# EAGLE design 140810_AriloTX_REV3_0_0_868MHZ_td (EAGLE 6.5.0)
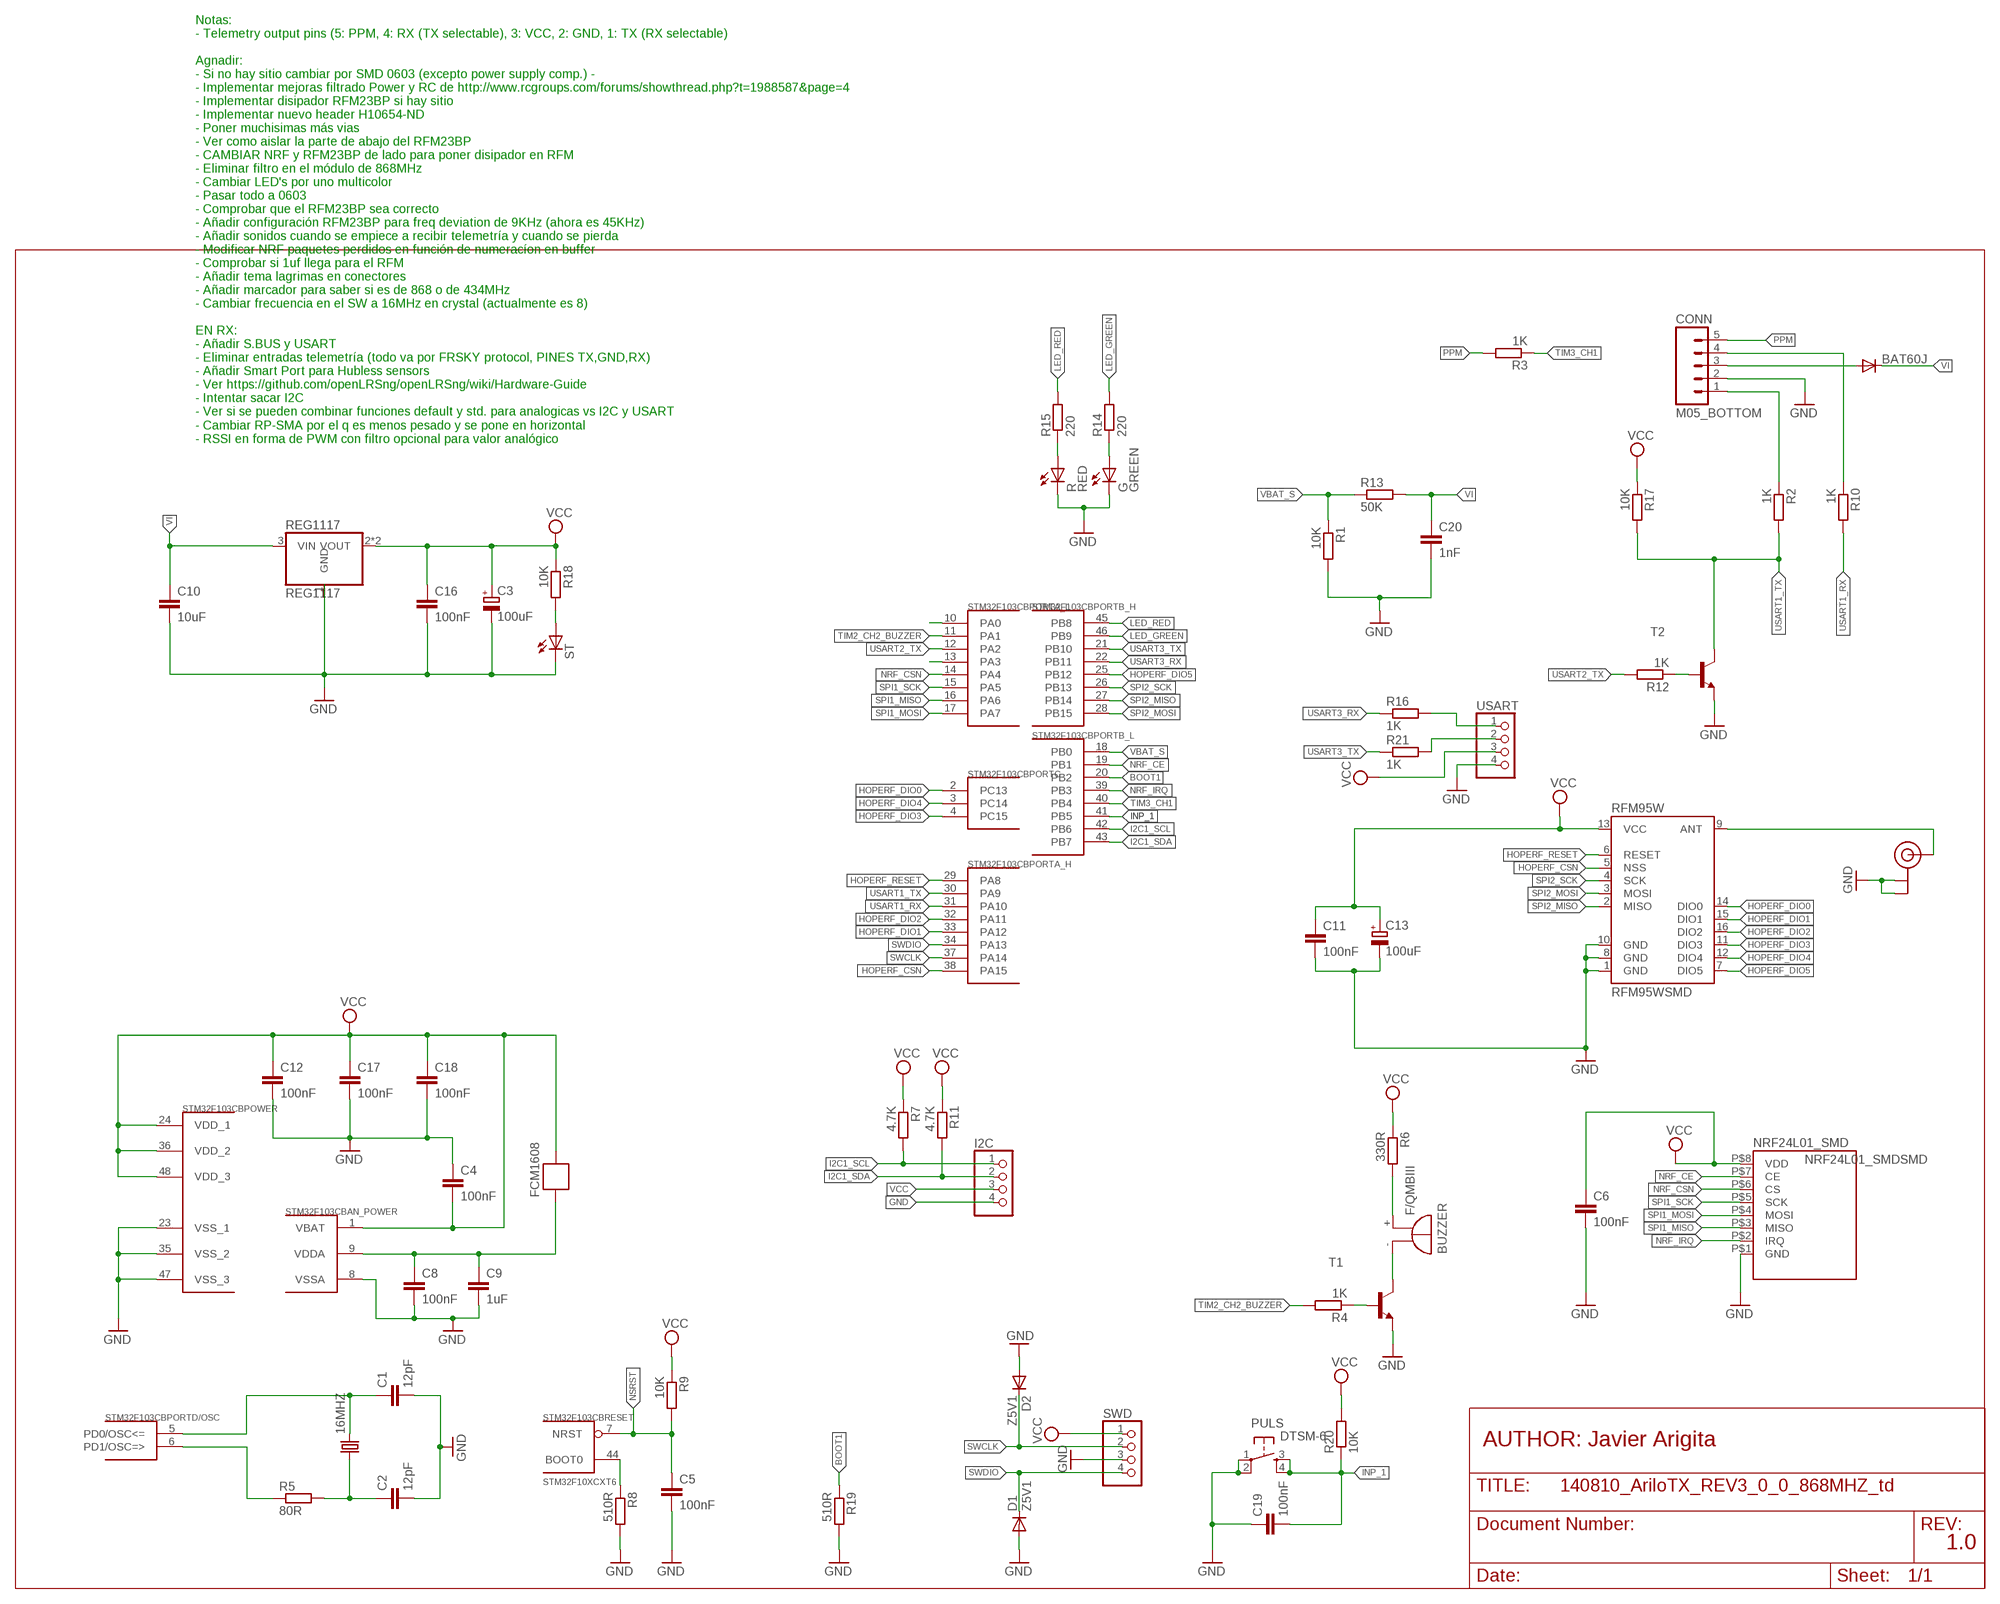
[diagram p0: schematic, sheet 1]

## Parts
16MHZ  CRYSTAL5X3  [CRYSTAL-SMD-5X3]
BAT60J  DIODE-SOD323-R  [SOD323-R]
BUZZER  F/QMBIII  [F/QMBIII]
C1  12pF  C-EUC0603  [C0603]
C2  12pF  C-EUC0603  [C0603]
C3  100uF  CPOL-EUSMCB  [SMC_B]
C4  100nF  C-EUC0603  [C0603]
C5  100nF  C-EUC0603  [C0603]
C6  100nF  C-EUC0603  [C0603]
C8  100nF  C-EUC0603  [C0603]
C9  1uF  C-EUC0603  [C0603]
C10  10uF  C-EUC3216  [C3216]
C11  100nF  C-EUC0603  [C0603]
C12  100nF  C-EUC0603  [C0603]
C13  100uF  CPOL-EUSMCB  [SMC_B]
C16  100nF  C-EUC0603  [C0603]
C17  100nF  C-EUC0603  [C0603]
C18  100nF  C-EUC0603  [C0603]
C19  100nF  C-EUC0603  [C0603]
C20  1nF  C-EUC0603  [C0603]
CONN  M05_BOTTOM  [M05_BOTTOM]
D1  Z5V1  DIODE-SOD323-R  [SOD323-R]
D2  Z5V1  DIODE-SOD323-R  [SOD323-R]
FCM1608  FERRITE-BEAD  [R0603]
G  GREEN  LEDCHIP-LED0603  [CHIP-LED0603]
I2C  PINHD-1X4  [1X04]
NRF24L01_SMD  NRF24L01_SMDSMD  [NRF24L01_SMD]
PULS  DTSM-6  [DTSM-6]
R  RED  LEDCHIP-LED0603  [CHIP-LED0603]
R1  10K  R-EU_R0603  [R0603]
R2  1K  R-EU_R0603  [R0603]
R3  1K  R-EU_R0603  [R0603]
R4  1K  R-EU_R0603  [R0603]
R5  80R  R-EU_R0603  [R0603]
R6  330R  R-EU_R0603  [R0603]
R7  4.7K  R-EU_R0603  [R0603]
R8  510R  R-EU_R0603  [R0603]
R9  10K  R-EU_R0603  [R0603]
R10  1K  R-EU_R0603  [R0603]
R11  4.7K  R-EU_R0603  [R0603]
R12  1K  R-EU_R0603  [R0603]
R13  50K  R-EU_R0603  [R0603]
R14  220  R-EU_R0603  [R0603]
R15  220  R-EU_R0603  [R0603]
R16  1K  R-EU_R0603  [R0603]
R17  10K  R-EU_R0603  [R0603]
R18  10K  R-EU_R0603  [R0603]
R19  510R  R-EU_R0603  [R0603]
R20  10K  R-EU_R0603  [R0603]
R21  1K  R-EU_R0603  [R0603]
REG1117  REG1117  [SOT223]
RFM95W  RFM95WSMD  MISIEK_RFM95WSMD  [MISIEK_RFM95W_SMD]
ST  LEDCHIP-LED0603  [CHIP-LED0603]
STM32F103CB  STM32F10XCXT6  [TQFP48]
SWD  PINHD-1X4  [1X04]
T1  BC848-NPN-SOT23-BEC  [SOT23-BEC]
T2  BC848-NPN-SOT23-BEC  [SOT23-BEC]
U.FL  U.FL  [U.FL]
USART  PINHD-1X4  [1X04]

## Nets
BOOT1: R19.1 STM32F103CB.20(PORTB_L:PB2)
GND: C1.2 C2.2 C3.- C4.1 C5.2 C6.2 C8.2 C9.2 C10.2 C11.2 C12.2 C13.- C16.2 C17.2 C18.2 C19.1 C20.2 CONN.2 D1.A D2.A G.C I2C.4 NRF24L01_SMD.P$1(GND) PULS.1 PULS.2 R1.2 R8.2 R19.2 R.C REG1117.1(GND) RFM95W.1(GND) RFM95W.8(GND) RFM95W.10(GND) ST.C STM32F103CB.8(AN_POWER:VSSA) STM32F103CB.23(POWER:VSS_1) STM32F103CB.35(POWER:VSS_2) STM32F103CB.47(POWER:VSS_3) SWD.3 T1.E T2.E U.FL.P$1(GND) U.FL.P$2(GND) USART.4
HOPERF_CSN: RFM95W.5(NSS) STM32F103CB.38(PORTA_H:PA15)
HOPERF_DIO0: RFM95W.14(DIO0) STM32F103CB.2(PORTC:PC13)
HOPERF_DIO1: RFM95W.15(DIO1) STM32F103CB.33(PORTA_H:PA12)
HOPERF_DIO2: RFM95W.16(DIO2) STM32F103CB.32(PORTA_H:PA11)
HOPERF_DIO3: RFM95W.11(DIO3) STM32F103CB.4(PORTC:PC15)
HOPERF_DIO4: RFM95W.12(DIO4) STM32F103CB.3(PORTC:PC14)
HOPERF_DIO5: RFM95W.7(DIO5) STM32F103CB.25(PORTB_H:PB12)
HOPERF_RESET: RFM95W.6(RESET) STM32F103CB.29(PORTA_H:PA8)
I2C1_SCL: I2C.1 R7.2 STM32F103CB.42(PORTB_L:PB6)
I2C1_SDA: I2C.2 R11.2 STM32F103CB.43(PORTB_L:PB7)
INP_1: C19.2 PULS.3 PULS.4 R20.1 STM32F103CB.41(PORTB_L:PB5)
LED_GREEN: R14.2 STM32F103CB.46(PORTB_H:PB9)
LED_RED: R15.2 STM32F103CB.45(PORTB_H:PB8)
N$1: 16MHZ.3 C1.1 STM32F103CB.5(PORTD/OSC:PD0/OSC<=)
N$2: R5.1 STM32F103CB.6(PORTD/OSC:PD1/OSC=>)
N$3: 16MHZ.1 C2.1 R5.2
N$4: R8.1 STM32F103CB.44(RESET:BOOT0)
N$5: R12.1 T2.B
N$6: CONN.1 R2.1
N$7: R15.1 R.A
N$8: G.A R14.1
N$9: CONN.4 R10.1
N$10: R18.2 ST.A
N$11: RFM95W.9(ANT) U.FL.P$3(SIGNAL)
N$12: R16.2 USART.1
N$13: R21.2 USART.2
N$14: BAT60J.A CONN.3
N$16: BUZZER.+(-) R6.2
N$17: C8.1 C9.1 FCM1608.2 STM32F103CB.9(AN_POWER:VDDA)
N$21: R4.1 T1.B
N$23: BUZZER.-(+) T1.C
N$24: STM32F103CB.10(PORTA_L:PA0)
N$27: STM32F103CB.13(PORTA_L:PA3)
NRF_CE: NRF24L01_SMD.P$7(CE) STM32F103CB.19(PORTB_L:PB1)
NRF_CSN: NRF24L01_SMD.P$6(CS) STM32F103CB.14(PORTA_L:PA4)
NRF_IRQ: NRF24L01_SMD.P$2(IRQ) STM32F103CB.39(PORTB_L:PB3)
NSRST: C5.1 R9.2 STM32F103CB.7(RESET:NRST)
PPM: CONN.5 R3.2
SPI1_MISO: NRF24L01_SMD.P$3(MISO) STM32F103CB.16(PORTA_L:PA6)
SPI1_MOSI: NRF24L01_SMD.P$4(MOSI) STM32F103CB.17(PORTA_L:PA7)
SPI1_SCK: NRF24L01_SMD.P$5(SCK) STM32F103CB.15(PORTA_L:PA5)
SPI2_MISO: RFM95W.2(MISO) STM32F103CB.27(PORTB_H:PB14)
SPI2_MOSI: RFM95W.3(MOSI) STM32F103CB.28(PORTB_H:PB15)
SPI2_SCK: RFM95W.4(SCK) STM32F103CB.26(PORTB_H:PB13)
SWCLK: D2.C STM32F103CB.37(PORTA_H:PA14) SWD.2
SWDIO: D1.C STM32F103CB.34(PORTA_H:PA13) SWD.4
TIM2_CH2_BUZZER: R4.2 STM32F103CB.11(PORTA_L:PA1)
TIM3_CH1: R3.1 STM32F103CB.40(PORTB_L:PB4)
USART1_RX: R10.2 STM32F103CB.31(PORTA_H:PA10)
USART1_TX: R2.2 R17.2 STM32F103CB.30(PORTA_H:PA9) T2.C
USART2_TX: R12.2 STM32F103CB.12(PORTA_L:PA2)
USART3_RX: R16.1 STM32F103CB.22(PORTB_H:PB11)
USART3_TX: R21.1 STM32F103CB.21(PORTB_H:PB10)
VBAT_S: R1.1 R13.1 STM32F103CB.18(PORTB_L:PB0)
VCC: C3.+ C4.2 C6.1 C11.1 C12.1 C13.+ C16.1 C17.1 C18.1 FCM1608.1 I2C.3 NRF24L01_SMD.P$8(VDD) R6.1 R7.1 R9.1 R11.1 R17.1 R18.1 R20.2 REG1117.2(VOUT) REG1117.4(VOUT) RFM95W.13(VCC) STM32F103CB.1(AN_POWER:VBAT) STM32F103CB.24(POWER:VDD_1) STM32F103CB.36(POWER:VDD_2) STM32F103CB.48(POWER:VDD_3) SWD.1 USART.3
VI: BAT60J.C C10.1 C20.1 R13.2 REG1117.3(VIN)

## Notes on the sheet
- Notas: 
  - Telemetry output pins (5: PPM, 4: RX (TX selectable), 3: VCC, 2: GND, 1: TX (RX selectable)
  
  Agnadir: 
  - Si no hay sitio cambiar por SMD 0603 (excepto power supply comp.) - 
  - Implementar mejoras filtrado Power y RC de http://www.rcgroups.com/forums/showthread.php?t=1988587&page=4 
  - Implementar disipador RFM23BP si hay sitio
  - Implementar nuevo header H10654-ND
  - Poner muchisimas más vias
  - Ver como aislar la parte de abajo del RFM23BP
  - CAMBIAR NRF y RFM23BP de lado para poner disipador en RFM
  - Eliminar filtro en el módulo de 868MHz
  - Cambiar LED's por uno multicolor
  - Pasar todo a 0603
  - Comprobar que el RFM23BP sea correcto
  - Añadir configuración RFM23BP para freq deviation de 9KHz (ahora es 45KHz)
  - Añadir sonidos cuando se empiece a recibir telemetría y cuando se pierda
  - Modificar NRF paquetes perdidos en función de numeracíon en buffer
  - Comprobar si 1uf llega para el RFM
  - Añadir tema lagrimas en conectores
  - Añadir marcador para saber si es de 868 o de 434MHz
  - Cambiar frecuencia en el SW a 16MHz en crystal (actualmente es 8)
  
  EN RX:
  - Añadir S.BUS y USART
  - Eliminar entradas telemetría (todo va por FRSKY protocol, PINES TX,GND,RX)
  - Añadir Smart Port para Hubless sensors
  - Ver https://github.com/openLRSng/openLRSng/wiki/Hardware-Guide
  - Intentar sacar I2C
  - Ver si se pueden combinar funciones default y std. para analogicas vs I2C y USART
  - Cambiar RP-SMA por el q es menos pesado y se pone en horizontal
  - RSSI en forma de PWM con filtro opcional para valor analógico
- AUTHOR: Javier Arigita
- 1.0

## Library data of the parts
16MHZ = SparkFun-FreqCtrl:CRYSTAL: Various standard crystals. Proven footprints. Spark Fun Electronics SKU : COM-00534
BAT60J D1 D2 = diode:DIODE-: DIODE
BUZZER = buzzer:F/QMBIII: BUZZER Source: Buerklin; OC_FARNELL: unknown; OC_NEWARK: unknown
C1 C2 C4-C6 C8 C9 C11 C12 C16-C20 = rcl:C-EU: CAPACITOR, European symbol
C3 C13 = rcl:CPOL-EU: POLARIZED CAPACITOR, European symbol
C10 = resistor:C-EU: CAPACITOR, European symbol
CONN = RFM23BP_new:M05_BOTTOM
FCM1608 = BaseApp:FERRITE-BEAD
G R ST = led:LED: LED OSRAM: - CHIPLED LG R971, LG N971, LY N971, LG Q971, LY Q971, LO R971, LY R971 LH N974, LH R974 LS Q976, LO Q976, LY Q976 LO Q996 - Hyper CHIPLED LW Q18S LB Q993, LB Q99A, LB R99A - SideLED LS A670, LO A670, LY A670, LG A670, LP A670 LB A673, LV A673, LT A673, LW A673 LH A674 LY A675 LS A676, LA A676, LO A676, LY A676, LW A676 LS A679, LY A679, LG A679 - Hyper Micro SIDELED® LS Y876, LA Y876, LO Y876, LY Y876 LT Y87S - SmartLED LW L88C, LW L88S LB L89C, LB L89S, LG L890 LS L89K, LO L89K, LY L89K LS L896, LA L896, LO L896, LY L896 - TOPLED LS T670, LO T670, LY T670, LG T670, LP T670 LSG T670, LSP T670, LSY T670, LOP T670, LYG T670 LG T671, LOG T671, LSG T671 LB T673, LV T673, LT T673, LW T673 LH T674 LS T676, LA T676, LO T676, LY T676, LB T676, LH T676, LSB T676, LW T676 LB T67C, LV T67C, LT T67C, LS T67K, LO T67K, LY T67K, LW E67C LS E67B, LA E67B, LO E67B, LY E67B, LB E67C, LV E67C, LT E67C LW T67C LS T679, LY T679, LG T679 LS T770, LO T770, LY T770, LG T770, LP T770 LB T773, LV T773, LT T773, LW T773 LH T774 LS E675, LA E675, LY E675, LS T675 LS T776, LA T776, LO T776, LY T776, LB T776 LHGB T686 LT T68C, LB T68C - Hyper Mini TOPLED® LB M676 - Mini TOPLED Santana® LG M470 LS M47K, LO M47K, LY M47K Source: http://www.osram.convergy.de LUXEON: - LUMILED® LXK2-PW12-R00, LXK2-PW12-S00, LXK2-PW14-U00, LXK2-PW14-V00 LXK2-PM12-R00, LXK2-PM12-S00, LXK2-PM14-U00 LXK2-PE12-Q00, LXK2-PE12-R00, LXK2-PE12-S00, LXK2-PE14-T00, LXK2-PE14-U00 LXK2-PB12-K00, LXK2-PB12-L00, LXK2-PB12-M00, LXK2-PB14-N00, LXK2-PB14-P00, LXK2-PB14-Q00 LXK2-PR12-L00, LXK2-PR12-M00, LXK2-PR14-Q00, LXK2-PR14-R00 LXK2-PD12-Q00, LXK2-PD12-R00, LXK2-PD12-S00 LXK2-PH12-R00, LXK2-PH12-S00 LXK2-PL12-P00, LXK2-PL12-Q00, LXK2-PL12-R00 Source: www.luxeon.com KINGBRIGHT: KA-3528ASYC Source: www.kingbright.com
I2C SWD USART = pinhead:PINHD-1X4: PIN HEADER
NRF24L01_SMD = NRF24L01+:NRF24L01_SMD
PULS = switch-tact:DTSM-6
R1-R21 = rcl:R-EU_: RESISTOR, European symbol
REG1117 = CEDT:REG1117: 800mA and 1A Low Dropout (LDO) Positive Regulator 1.8V, 2.5V, 2.85V, 3.3V, 5V, and Adj
RFM95W = RFM95W:MISIEK_RFM95W
STM32F103CB = stm32:STM32F10XCXT6: ST STM32F101/103 48pin LQFP
T1 T2 = transistor:*-NPN-: NPN Transistror BF959 corrected 2008.03.06
U.FL = SparkFun-Connectors:U.FL: SMD antenna connector- WRL-09144

## Board
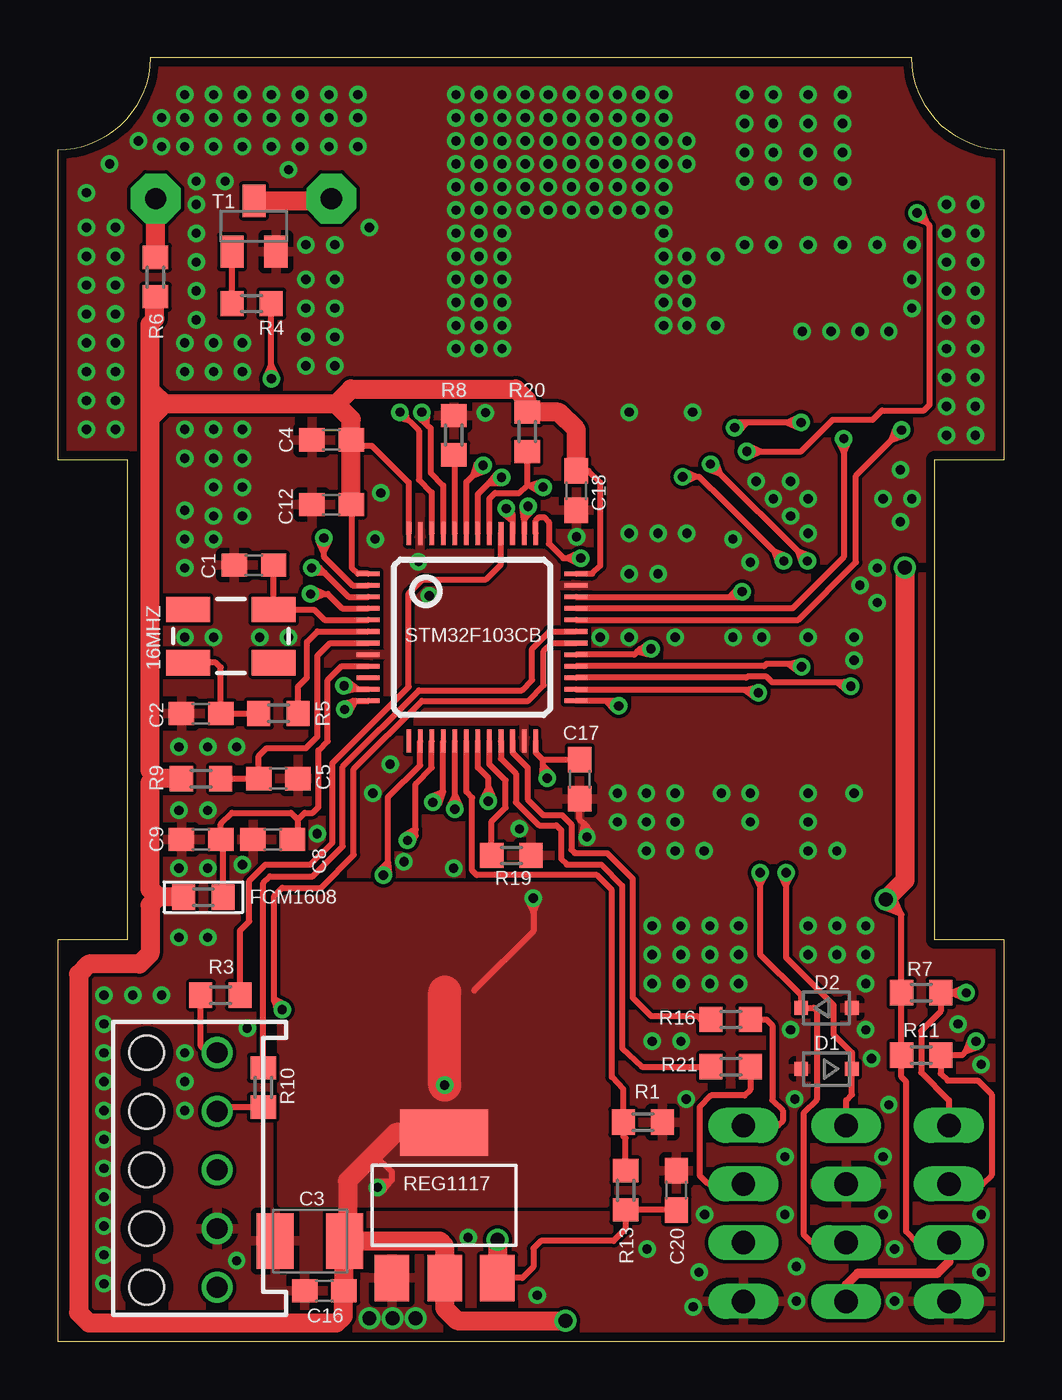
[diagram p1: board, top side]
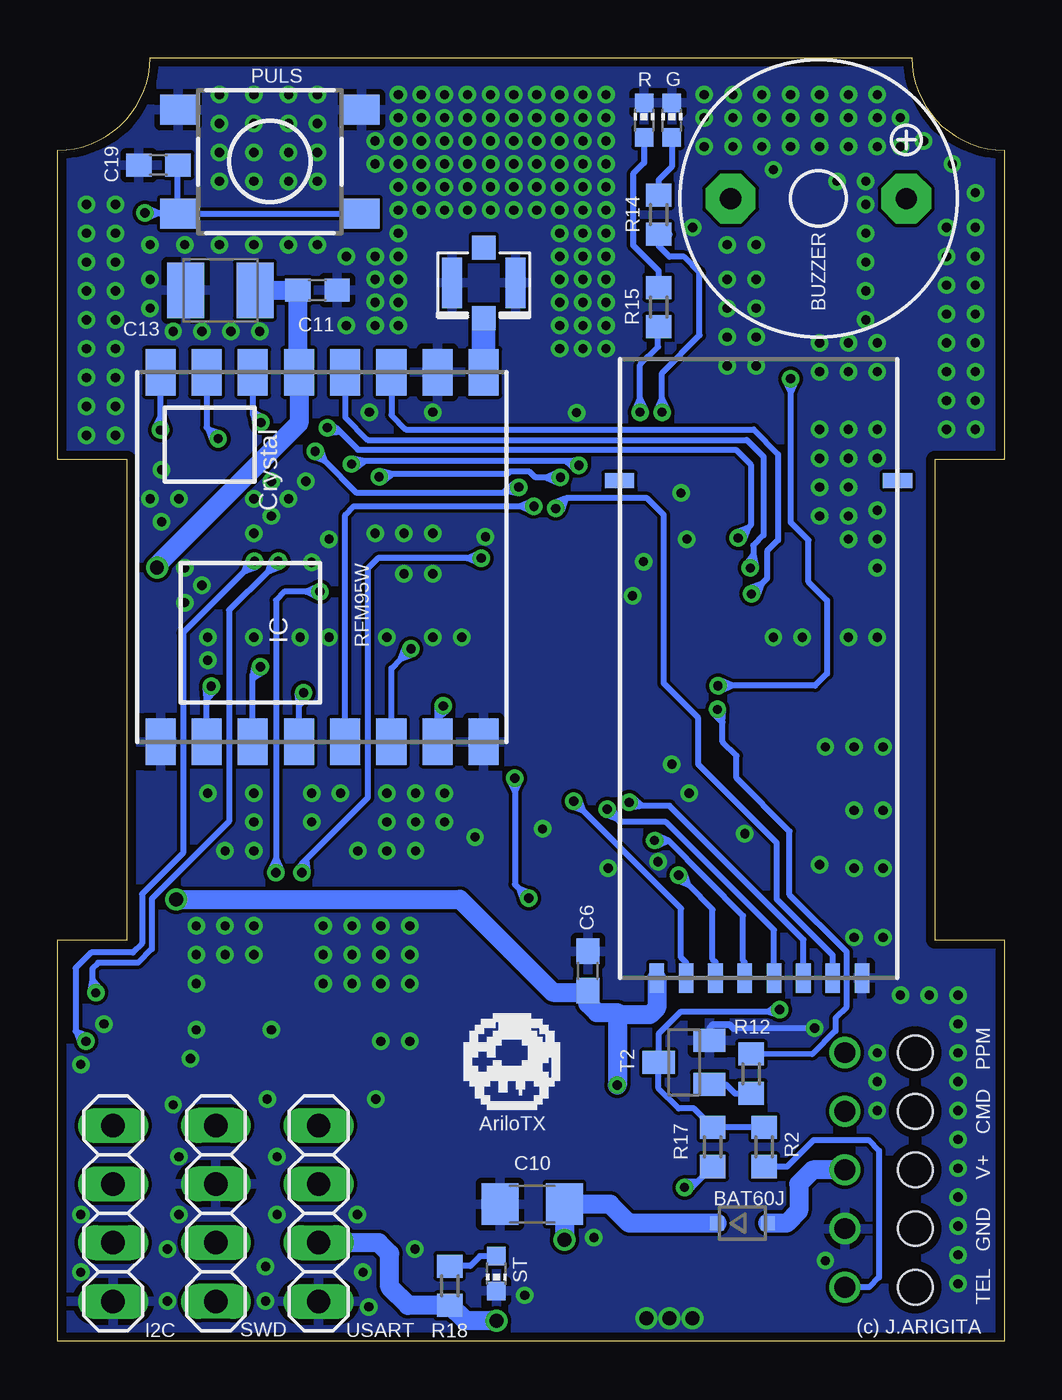
[diagram p2: board, bottom side, seen from below]

Size 41 x 55.6 mm. Coordinates in mm from the lower left corner, seen from the top.
Outline: 0,0 41,0 41,17.4 38,17.4 38,38.2 41,38.2 41,51.6 arc-90 37,55.6 4,55.6 arc-90 0,51.6 0,38.2 3,38.2 3,17.4 0,17.4 0,0
Copper layers (1*16): Top 0.0356mm / dielectric 1.5011mm / Bottom 0.0356mm
Design rules "LaenPCBOrder": minimum track width 6mil, minimum drill 13mil, track to track 6mil, track to pad 6mil, pad to pad 6mil, via to via 6mil, smd to smd 6mil, copper to edge 15mil, drill to drill 6mil, minimum pad ring 7mil, minimum via ring 7mil, stop-mask expansion 4mil, vias tented up to drill 0mil, thermal gap 10mil

### Footprints (pad centres in the part's own frame; a part is rotated, then mirrored left to right if it is on the bottom)
CRYSTAL-SMD-5X3 = smd 1.9 x 1.1: 1 -1.85,-1.15; 2 1.85,-1.15; 3 1.85,1.15; 4 -1.85,1.15
SOD323-R = smd 0.6 x 0.6: A 1.1,0; C -1.1,0
F/QMBIII = drill 0.914 pad 2.159 octagon: + 3.8,0; - -3.8,0
C0603 = smd 1.1 x 1: 1 -0.85,0; 2 0.85,0
SMC_B = smd 1.6 x 2.4: + -1.5,0; - 1.5,0
C3216 = smd 1.6 x 1.8: 1 -1.4,0; 2 1.4,0
M05_BOTTOM = drill 0.9: 1 -5.1,-1.5; 2 -2.56,-1.5; 3 -0.02,-1.5; 4 2.52,-1.5; 5 5.06,-1.5 | hole 1.5: -5.1,1.54; -2.56,1.54; -0.02,1.54; 2.52,1.54; 5.06,1.54
R0603 = smd 1 x 1.1: 1 -0.85,0; 2 0.85,0
CHIP-LED0603 = smd 0.8 x 0.8: A 0,-0.75; C 0,0.75
1X04 = drill 1.016 long: 1 -3.81,0; 2 -1.27,0; 3 1.27,0; 4 3.81,0
NRF24L01_SMD = smd 1.27 x 0.635: P$1 26.807,10.492; P$2 26.807,9.222; P$3 26.807,7.952; P$4 26.807,6.682; P$5 26.807,5.412; P$6 26.807,4.142; P$7 26.807,2.872; P$8 26.807,1.602 | smd 0.635 x 1.27: P$11 5.267,-0.018; P$13 5.267,12.032
DTSM-6 = smd 1.55 x 1.3: 1 -3.975,2.25; 2 3.975,2.25; 3 -3.975,-2.25; 4 3.975,-2.25
SOT223 = smd 1.499 x 2.007: 1 -2.261,-3.15; 2 0.025,-3.15; 3 2.311,-3.15 | smd 3.81 x 2.007: 4 0,3.15
MISIEK_RFM95W_SMD = smd 2 x 1.3: 1 -8,7; 2 -8,5; 3 -8,3; 4 -8,1; 5 -8,-1; 6 -8,-3; 7 -8,-5; 8 -8,-7; 9 8,-7; 10 8,-5; 11 8,-3; 12 8,-1; 13 8,1; 14 8,3; 15 8,5; 16 8,7
TQFP48 = smd 0.2 x 1: 1 -2.75,-4.5; 2 -2.25,-4.5; 3 -1.75,-4.5; 4 -1.25,-4.5; 5 -0.75,-4.5; 6 -0.25,-4.5; 7 0.25,-4.5; 8 0.75,-4.5; 9 1.25,-4.5; 10 1.75,-4.5; 11 2.25,-4.5; 12 2.75,-4.5; 25 2.75,4.5; 26 2.25,4.5; 27 1.75,4.5; 28 1.25,4.5; 29 0.75,4.5; 30 0.25,4.5; 31 -0.25,4.5; 32 -0.75,4.5; 33 -1.25,4.5; 34 -1.75,4.5; 35 -2.25,4.5; 36 -2.75,4.5 | smd 1 x 0.2: 13 4.5,-2.75; 14 4.5,-2.25; 15 4.5,-1.75; 16 4.5,-1.25; 17 4.5,-0.75; 18 4.5,-0.25; 19 4.5,0.25; 20 4.5,0.75; 21 4.5,1.25; 22 4.5,1.75; 23 4.5,2.25; 24 4.5,2.75; 37 -4.5,2.75; 38 -4.5,2.25; 39 -4.5,1.75; 40 -4.5,1.25; 41 -4.5,0.75; 42 -4.5,0.25; 43 -4.5,-0.25; 44 -4.5,-0.75; 45 -4.5,-1.25; 46 -4.5,-1.75; 47 -4.5,-2.25; 48 -4.5,-2.75
SOT23-BEC = smd 1 x 1.4: B -0.95,-1.1; C 0,1.1; E 0.95,-1.1
U.FL = smd 2.2 x 0.85: P$1 0,1.375; P$2 0,-1.375 | smd 1.05 x 1: P$3 1.525,0; P$4 -1.525,0

### Placement (x,y rotation side)
16MHZ  7.5,30.55 0 top
BAT60J  11.34,5.12 0 bottom
BUZZER  8.05,49.5 0 bottom
C1  8.5,33.62 180 top
C2  6.21,27.2 180 top
C3  10.93,4.35 180 top
C4  11.86,39.05 0 top
C5  9.56,24.38 0 top
C6  18.04,16.05 90 bottom
C8  9.31,21.75 180 top
C9  6.21,21.75 180 top
C10  20.45,5.95 180 bottom
C11  29.75,45.52 0 bottom
C12  11.86,36.25 180 top
C13  33.95,45.52 180 bottom
C16  11.55,2.2 180 top
C17  22.61,24.35 270 top
C18  22.46,36.85 270 top
C19  36.63,50.95 0 bottom
C20  26.8,6.55 90 top
CONN  5.4,7.45 90 top
D1  33.3,11.8 180 top
D2  33.3,14.45 0 top
FCM1608  6.31,19.25 0 top
G  14.4,52.9 0 bottom
I2C  38.6,5.55 270 bottom
NRF24L01_SMD  16.65,42.55 270 bottom
PULS  31.81,51.1 0 bottom
R  15.6,52.9 0 bottom
R1  25.35,9.5 0 top
R2  10.4,8.43 90 bottom
R3  7.05,15 180 top
R4  8.4,44.95 0 top
R5  9.56,27.2 180 top
R6  4.24,46.1 90 top
R7  37.4,15.1 0 top
R8  17.16,39.25 90 top
R9  6.21,24.38 0 top
R10  8.9,11 90 top
R11  37.4,12.4 0 top
R12  10.96,11.6 90 bottom
R13  24.6,6.55 270 top
R14  14.97,48.8 270 bottom
R15  14.97,44.8 270 bottom
R16  29.15,13.95 0 top
R17  12.62,8.43 90 bottom
R18  24.02,2.41 90 bottom
R19  19.65,21.05 0 top
R20  20.34,39.4 90 top
R21  29.15,11.9 0 top
REG1117  16.74,5.9 0 top
RFM95W  29.55,33.98 90 bottom
ST  22,2.94 180 bottom
STM32F103CB  17.95,30.5 270 top
SWD  34.15,5.55 90 bottom
T1  8.5,48.3 0 top
T2  13.87,12.09 90 bottom
U.FL  22.55,45.85 270 bottom
USART  29.7,5.55 270 bottom

### Tracks (layer width: path | path; a pad name or v marks a point on that pad's centre or on a via)
BOOT1
  Top 0.254: R19.1 18.8,22.52 19.4,23.12 19.4,24.3 18.7,25 STM32F103CB.20
GND  (via drill 0.4, 0.6)
  Top 0.254: v22.93,21.85 22.93,22.3 22.79,22.43 | 22.79,22.43 22.61,22.61 C17.2 | 22.79,22.43 22.68,21.9 v22.93,21.85 | 22.79,22.43 23.12,22 v22.93,21.85
  Bottom 0.254: v8.21,13.57 v8.22,13.56 11.73,13.56 | 12.65,13.71 12.77,13.59 T2.E
  Bottom 0.305: 11.73,13.56 11.88,13.71 12.65,13.71
  other vias: 13.75,34.75 16.1,32.3 18.25,54 18.25,53 18.25,52 18.25,51 13,54 11.75,54 10.5,54 9.25,54 8,54 6.75,54 5.5,54 4.5,53 3.5,52 2.25,51 1.25,49.75 1.25,48.25 1.25,47 1.25,45.75 1.25,44.5 1.25,43.25 1.25,42 1.25,40.75 1.25,39.5 2.5,39.5 2.5,40.75 2.5,42 2.5,43.25 2.5,44.5 2.5,45.75 2.5,47 2.5,48.25 4.5,51.75 5.5,53 5.5,51.75 6.75,53 6.75,51.75 8,53 8,51.75 9.25,53 9.25,51.75 10.5,53 10.5,51.75 11.75,53 11.75,51.75 13,53 13,51.75 6,48 6,49.25 6,50.25 7.25,50.25 10,50.75 6,46.75 6,45.5 6,44.25 5.5,43.25 5.5,42 6.75,43.25 6.75,42 8,43.25 8,42 5.5,39.5 5.5,38.25 5.5,36 5.5,34.75 5.5,33.5 6.75,39.5 6.75,38.25 8,39.5 8,38.25 6.75,37 6.75,35.75 6.75,34.75 8,37 8,35.75 13.5,48.25 12,47.5 12,46 12,44.75 12,43.5 12,42.25 10.75,42.25 10.75,43.5 10.75,44.75 10.75,46 10.75,47.5 14,36.75 5.25,25.75 6.5,25.75 7.75,25.75 5.25,23 6.5,23 5.25,20.5 6.5,20.5 3.25,15 2,15 2,13.75 2,12.5 2,11.25 2,10 2,8.75 2,7.5 2,6.25 2,5 2,3.75 2,2.5 5.5,10 5.5,11.25 5.5,12.5 13.65,23.75 14.4,25 17.15,20.5 11.24,21.99 32,3.25 32,1.75 36.25,1.75 18.25,50 18.25,49 18.25,47 18.25,46 18.25,45 18.25,44 19.25,45 19.25,44 39.75,43 39.75,41.75 38.5,41.75 38.5,40.5 39.75,40.5 39.75,39.25 38.5,39.25 33.75,18 33.75,16.75 28.02,5.5 27.23,10.5 36.25,4 31.5,5.5 31.5,8 35.75,8 36,10.25 39,13.75 40,12 40,5.5 40,3 35.75,5.5 7.75,3.5 20,22.2 15,20.77 22.48,34.85 31.93,10.5 6.5,17.5 8,20.65 18.25,48 13.5,1 14.5,1 15.5,1 18.52,40.23 17.25,54 17.25,53 17.25,52 17.25,51 17.25,50 17.25,49 17.25,48 17.25,47 17.25,46 17.25,45 17.25,44 17.25,43 18.25,43 19.25,43 19.25,46 19.25,47 19.25,48 19.25,49 19.25,50 19.25,51 19.25,52 19.25,53 19.25,54 20.25,54 20.25,53 21.25,54 22.25,54 23.25,54 24.25,54 25.25,54 26.25,54 25.25,53 26.25,53 25.25,52 25.25,51 26.25,52 26.25,51 26.25,50 25.25,50 25.25,49 26.25,49 26.25,48 26.25,47 26.25,46 26.25,45 26.25,44 27.25,44 27.25,45 27.25,46 27.25,47 27.25,52 27.25,51 29.75,54 31,54 29.75,52.75 31,52.75 29.75,51.5 31,51.5 29.75,50.25 31,50.25 32.5,50.25 32.5,54 32.5,52.75 32.5,51.5 29.75,47.5 31,47.5 32.5,47.5 34,47.5 34,50.25 34,51.5 34,52.75 34,54 28.5,47 28.5,44 32.25,43.75 33.5,43.75 34.75,43.75 36,43.75 37,44.75 37,46 35.5,47.5 37,47.5 38.5,43 38.5,44.25 38.5,45.5 38.5,46.75 38.5,48 39.75,44.25 39.75,45.5 39.75,46.75 39.75,48 39.75,49.25 38.5,49.25 24.75,40.25 27.5,40.25 24.75,35 26,35 27.25,35 24.75,33.25 26,33.25 29.25,34.75 30,33.75 30.25,37.25 31,36.5 31.75,35.75 32.5,35 32.5,36.5 31.75,37.25 35.75,36.5 36.5,35.5 36.5,37.75 37,36.5 35.5,32 34.5,30.5 34.5,29.5 32.5,30.5 30.5,30.5 29.25,30.5 26.75,30.5 24.75,30.5 23.5,30.5 34.75,32.75 35.5,33.5 5.5,30.5 6.75,30.5 8.75,30.5 10,30.5 15.62,33.77 5.25,17.5 4.5,15 24.25,23.75 25.5,23.75 25.5,22.5 24.25,22.5 25.5,21.25 26.75,21.25 26.75,22.5 26.75,23.75 28,21.25 25.75,18 27,18 28.25,18 25.75,16.75 27,16.75 28.25,16.75 27,15.5 25.75,15.5 25.75,13 27,13 28.25,15.5 29.5,15.5 29.5,16.75 29.5,18 32.5,18 32.5,16.75 35,18 35,16.75 35,15.5 35,13.5 35.25,12.25 31.75,13.5 27.77,3 27.52,1.5 25.52,4 20.77,2 17.77,4.5 28.75,23.75 30,23.75 30,22.5 32.5,22.5 32.5,23.75 32.5,21.25 33.75,21.25 34.5,23.75 21.25,53 22.25,53 23.25,53 24.25,53 24.25,52 23.25,52 22.25,52 21.25,52 20.25,52 20.25,51 21.25,51 22.25,51 23.25,51 24.25,51 24.25,50 23.25,50 22.25,50 21.25,50 20.25,50 20.25,49 21.25,49 22.25,49 23.25,49 24.25,49
  pour Top (rank 2): 40.75,17.15 37.75,17.15 37.75,38.45 40.75,38.45 40.75,51.1 arc-90 36.5,55.35 4.5,55.35 arc-90 0.25,51.1 0.25,38.45 3.25,38.45 3.25,17.15 0.25,17.15 0.25,0.25 40.75,0.25
  pour Bottom (rank 2): 40.75,17.15 37.75,17.15 37.75,38.45 40.75,38.45 40.75,51.1 arc-90 36.5,55.35 4.5,55.35 arc-90 0.25,51.1 0.25,38.45 3.25,38.45 3.25,17.15 0.25,17.15 0.25,0.25 40.75,0.25
HOPERF_CSN  (via drill 0.4)
  Top 0.254: v20.38,36.17 20.2,35.95 20.2,35.6 | 20.2,35.6 STM32F103CB.38 | 20.2,35.6 20.56,36.01 v20.38,36.17 | 20.2,35.6 20.13,36.14 v20.38,36.17
  Bottom 0.254: RFM95W.5 28.55,35.8 28.18,36.17 20.98,36.17 | 20.98,36.17 v20.38,36.17 | 20.98,36.17 20.48,36.4 v20.38,36.17 | 20.98,36.17 20.48,35.95 v20.38,36.17
HOPERF_DIO0  (via drill 0.4)
  Top 0.254: v32.2,39.8 31.6,39.8 | 31.6,39.8 29.88,39.8 | 29.88,39.8 29.55,39.8 v29.32,39.58 | v11.53,34.8 11.53,34.2 | 11.53,34.2 11.53,34 12.78,32.75 STM32F103CB.2 | 31.6,39.8 32.09,39.57 v32.2,39.8 | 31.6,39.8 32.09,40.03 v32.2,39.8 | 29.88,39.8 29.34,39.83 v29.32,39.58 | 29.88,39.8 29.51,39.4 v29.32,39.58 | 11.53,34.2 11.75,34.7 v11.53,34.8 | 11.53,34.2 11.3,34.7 v11.53,34.8
  Bottom 0.254: RFM95W.14 32.55,40.29 | 32.55,40.29 32.55,40.15 v32.2,39.8 | v29.32,39.58 28.95,39.58 28.76,39.38 | 28.76,39.38 28,38.62 11.62,38.62 10.97,37.98 10.97,35.35 11.1,35.22 | 11.1,35.22 v11.53,34.8 | 32.55,40.29 32.08,40.02 v32.2,39.8 | 32.55,40.29 32.45,39.75 v32.2,39.8 | 28.76,39.38 29.3,39.33 v29.32,39.58 | 28.76,39.38 29.15,39.76 v29.32,39.58 | 11.1,35.22 11.29,34.71 v11.53,34.8 | 11.1,35.22 11.61,35.03 v11.53,34.8
HOPERF_DIO1  (via drill 0.4)
  Top 0.254: v34.05,39.1 34.05,38.5 | 34.05,38.5 34.05,33.98 31.82,31.75 STM32F103CB.33 | 34.05,38.5 34.28,38.99 v34.05,39.1 | 34.05,38.5 33.82,38.99 v34.05,39.1
  Bottom 0.254: RFM95W.15 34.55,39.6 34.47,39.52 | 34.47,39.52 v34.05,39.1 | 34.47,39.52 33.96,39.34 v34.05,39.1 | 34.47,39.52 34.28,39.01 v34.05,39.1
HOPERF_DIO2  (via drill 0.4)
  Top 0.254: STM32F103CB.32 32.08,31.25 34.58,33.75 34.58,37.5 36.13,39.05 | 36.13,39.05 v36.55,39.48 | 36.13,39.05 36.64,39.24 v36.55,39.48 | 36.13,39.05 36.31,39.56 v36.55,39.48
  Bottom 0.254: v36.55,39.48 36.55,40.08 | 36.55,40.08 RFM95W.16 | 36.55,40.08 36.32,39.58 v36.55,39.48 | 36.55,40.08 36.78,39.58 v36.55,39.48
HOPERF_DIO3  (via drill 0.4)
  Top 0.254: v10.95,32.38 11.55,32.38 | 11.55,32.38 11.7,32.38 12.32,31.75 STM32F103CB.4 | 11.55,32.38 11.05,32.6 v10.95,32.38 | 11.55,32.38 11.05,32.15 v10.95,32.38
  Bottom 0.254: RFM95W.11 26.55,40.12 25.93,39.5 10.85,39.5 9.8,38.42 9.8,34.7 10.28,34.23 10.28,33.05 10.53,32.8 | 10.53,32.8 v10.95,32.38 | 10.53,32.8 10.71,32.29 v10.95,32.38 | 10.53,32.8 11.04,32.61 v10.95,32.38
HOPERF_DIO4  (via drill 0.4)
  Top 0.254: v11,33.5 11.35,33.5 11.56,33.29 | 11.56,33.29 12.6,32.25 STM32F103CB.3 | 11.56,33.29 11.18,33.68 v11,33.5 | 11.56,33.29 11.02,33.25 v11,33.5
  Bottom 0.254: RFM95W.12 28.55,40.02 27.57,39.05 11.15,39.05 10.43,38.33 10.43,34.92 10.88,34.48 10.88,34.09 | 10.88,34.09 10.88,33.62 v11,33.5 | 10.88,34.09 10.76,33.55 v11,33.5 | 10.88,34.09 11.2,33.65 v11,33.5
HOPERF_DIO5  (via drill 0.4)
  Top 0.254: v24.3,27.52 24.07,27.75 23.74,27.75 | 23.74,27.75 STM32F103CB.25 | 23.74,27.75 24.12,27.35 v24.3,27.52 | 23.74,27.75 24.29,27.78 v24.3,27.52
  Bottom 0.254: RFM95W.7 24.55,26.98 | 24.55,26.98 24.55,27.3 v24.3,27.52 | 24.55,26.98 24.55,27.52 v24.3,27.52 | 24.55,26.98 24.14,27.34 v24.3,27.52
HOPERF_RESET  (via drill 0.4)
  Top 0.254: v25.7,30 25.23,30 25.11,29.89 | 25.11,29.89 24.98,29.75 STM32F103CB.29 | 25.11,29.89 25.64,29.76 v25.7,30 | 25.11,29.89 25.55,30.2 v25.7,30
  Bottom 0.254: RFM95W.6 26.55,29.15 26.12,29.58 | 26.12,29.58 v25.7,30 | 26.12,29.58 25.93,30.09 v25.7,30 | 26.12,29.58 25.61,29.77 v25.7,30
I2C1_SCL  (via drill 0.4)
  Top 0.254: I2C.1 38.6,10.45 37.4,11.65 37.4,13.45 38.25,14.3 R7.2 38.75,15.1 | STM32F103CB.42 18.2,36.7 18.68,37.18 | 18.68,37.18 18.93,37.42 v19.23,37.42 | v27.07,37.45 27.68,37.45 | 27.68,37.45 27.77,37.45 28.9,36.35 31.03,34.22 | 31.03,34.22 v31.45,33.8 | v39.35,15.1 38.75,15.1 | 18.68,37.18 19.22,37.17 v19.23,37.42 | 18.68,37.18 19.04,37.59 v19.23,37.42 | 27.68,37.45 27.18,37.68 v27.07,37.45 | 27.68,37.45 27.18,37.22 v27.07,37.45 | 31.03,34.22 31.21,33.71 v31.45,33.8 | 31.03,34.22 31.54,34.03 v31.45,33.8 | 38.75,15.1 39.24,14.87 v39.35,15.1 | 38.75,15.1 39.24,15.33 v39.35,15.1
  Bottom 0.254: v19.23,37.42 19.82,37.42 | 19.82,37.42 20.3,37.42 20.57,37.67 21.43,37.67 21.52,37.58 26.49,37.58 | 26.49,37.58 26.73,37.58 26.85,37.45 v27.07,37.45 | v31.45,33.8 31.87,33.38 | 31.87,33.38 33.58,31.68 33.58,22.52 36.92,19.18 36.92,17 37.52,16.4 39.25,16.4 39.5,16.15 39.5,15.68 | 39.5,15.68 39.5,15.25 v39.35,15.1 | 19.82,37.42 19.33,37.65 v19.23,37.42 | 19.82,37.42 19.33,37.2 v19.23,37.42 | 26.49,37.58 26.93,37.25 v27.07,37.45 | 26.49,37.58 27.02,37.7 v27.07,37.45 | 31.87,33.38 31.68,33.89 v31.45,33.8 | 31.87,33.38 31.36,33.56 v31.45,33.8 | 39.5,15.68 39.16,15.26 v39.35,15.1 | 39.5,15.68 39.6,15.14 v39.35,15.1
I2C1_SDA  (via drill 0.4)
  Top 0.254: 38.15,12.5 R11.2 | R11.2 38.25,11.6 38.55,11.3 39.85,11.3 40.45,10.7 40.45,7.2 40.05,6.8 38.63,6.8 I2C.2 | STM32F103CB.43 17.7,37.23 18,37.53 | 18,37.53 v18.43,37.95 | v28.27,38 28.7,37.58 | 28.7,37.58 32.05,34.22 | 32.05,34.22 v32.48,33.8 | v39.77,13 39.35,12.58 | 39.35,12.58 39.17,12.4 R11.2 | 18,37.53 18.51,37.72 v18.43,37.95 | 18,37.53 18.19,38.04 v18.43,37.95 | 28.7,37.58 28.51,38.09 v28.27,38 | 28.7,37.58 28.19,37.77 v28.27,38 | 32.05,34.22 32.24,33.71 v32.48,33.8 | 32.05,34.22 32.56,34.03 v32.48,33.8 | 39.35,12.58 39.86,12.77 v39.77,13 | 39.35,12.58 39.54,13.09 v39.77,13
  Bottom 0.254: v18.43,37.95 18.6,38.12 19,38.12 | 19,38.12 27.69,38.12 | 27.69,38.12 28.15,38.12 v28.27,38 | v32.48,33.8 32.9,33.38 | 32.9,33.38 35.58,30.7 35.58,21.15 37.35,19.38 37.35,17.25 37.75,16.85 39.55,16.85 40.23,16.18 40.23,13.45 40.2,13.42 | 40.2,13.42 v39.77,13 | 19,38.12 18.46,38.2 v18.43,37.95 | 19,38.12 18.59,37.76 v18.43,37.95 | 27.69,38.12 28.12,37.8 v28.27,38 | 27.69,38.12 28.22,38.24 v28.27,38 | 32.9,33.38 32.71,33.89 v32.48,33.8 | 32.9,33.38 32.39,33.56 v32.48,33.8 | 40.2,13.42 39.69,13.23 v39.77,13 | 40.2,13.42 40.01,12.91 v39.77,13
INP_1  (via drill 0.4)
  Top 0.254: STM32F103CB.41 18.7,36.5 18.95,36.75 20,36.75 20.35,37.08 | 20.35,37.08 20.35,38.34 R20.1 | v21.02,37 20.82,37 20.73,37.08 20.43,37.08 | v29.85,38.55 30.45,38.55 | 30.45,38.55 32.2,38.55 33.58,39.92 35.3,39.92 35.7,40.33 37.52,40.33 37.77,40.58 37.77,48.33 37.65,48.45 | 37.65,48.45 v37.23,48.88 | 20.43,37.08 20.35,37.08 | 20.43,37.08 20.89,36.79 v21.02,37 | 20.43,37.08 20.95,37.24 v21.02,37 | 30.45,38.55 29.95,38.78 v29.85,38.55 | 30.45,38.55 29.95,38.32 v29.85,38.55 | 37.65,48.45 37.46,48.96 v37.23,48.88 | 37.65,48.45 37.14,48.64 v37.23,48.88
  Bottom 0.254: v21.02,37 21.45,37 21.61,36.84 | 21.61,36.84 21.7,36.75 28.05,36.75 29.43,38.13 | 29.43,38.13 v29.85,38.55 | v37.23,48.88 36.62,48.88 | 36.62,48.88 35.81,48.88 35.81,50.92 C19.2 | PULS.3 PULS.4 | 21.61,36.84 21.18,37.19 v21.02,37 | 21.61,36.84 21.07,36.75 v21.02,37 | 29.43,38.13 29.94,38.31 v29.85,38.55 | 29.43,38.13 29.61,38.64 v29.85,38.55 | 36.62,48.88 37.12,48.65 v37.23,48.88 | 36.62,48.88 37.12,49.1 v37.23,48.88
  Bottom 1.016: PULS.3 35.81,48.88
LED_GREEN  (via drill 0.4)
  Top 0.254: v14.82,40.25 15.65,39.45 15.65,37.33 16.2,36.77 STM32F103CB.46 | v14.82,40.25 15.06,40.34 15.13,39.91 14.74,40.01 v14.82,40.25
  Bottom 0.254: 14.5,47.95 R14.2 14.97,47.45 14.5,46.98 13.88,46.98 13.2,46.3 13.2,43.58 14.82,41.95 14.82,40.85 | v14.82,40.25 14.82,40.85 | 14.82,40.85 14.6,40.35 v14.82,40.25 | 14.82,40.85 15.05,40.35 v14.82,40.25
LED_RED  (via drill 0.4)
  Top 0.254: 16,39.7 15.78,39.92 v15.78,40.25 | 16,39.7 16.15,39.55 16.15,37.62 16.7,37.08 STM32F103CB.45 | 16,39.7 16.03,40.24 v15.78,40.25 | 16,39.7 15.61,40.07 v15.78,40.25
  Bottom 0.254: v15.78,40.25 15.78,40.85 | 15.78,40.85 15.78,42.3 15,43.08 15,43.92 R15.2 | 15.78,40.85 15.55,40.35 v15.78,40.25 | 15.78,40.85 16,40.35 v15.78,40.25
N$1
  Top 0.254: C1.1 16MHZ.3 11.1,31.7 11.55,31.25 STM32F103CB.5
N$2
  Top 0.254: R5.1 10.41,28.36 10.8,28.75 10.8,30.3 11.25,30.75 STM32F103CB.6
N$3
  Top 0.254: 16MHZ.1 6.85,29.4 7.06,29.19 C2.1 R5.2
N$4
  Top 0.254: STM32F103CB.44 17.2,38.34 R8.1
N$5
  Bottom 0.254: T2.B 12.27,11.13 12.05,11.13 11.66,10.74 R12.1
N$6
  Bottom 0.254: R2.1 9.4,7.58 8.25,8.72 5.88,8.72 5.42,8.28 5.42,2.77 5.85,2.35 CONN.1
N$7
  Bottom 0.254: R.A 15.6,51.05 16.07,50.58 16.07,47.48 14.97,46.38 R15.1
N$8
  Bottom 0.254: G.A 14.4,50.88 14.97,50.3 R14.1
N$9
  Top 0.254: R10.1 7.08,10.15 CONN.4
N$10
  Bottom 0.254: ST.A 22.71,3.69 23.12,3.27 24.01,3.27 R18.2
N$11
  Bottom 1.016: RFM95W.9 U.FL.P$3
N$12
  Top 0.254: R16.2 30.7,13.95 30.95,13.7 30.95,10.45 31.4,10 31.4,9.55 31.2,9.35 USART.1
N$13
  Top 0.254: R21.2 30,10.9 29.75,10.65 28.3,10.65 27.8,10.15 27.8,7.2 28.15,6.85 29.67,6.85 USART.2
N$14
  Bottom 0.813: CONN.3 8.29,7.43 8.9,6.83 8.9,5.65 9.43,5.12 BAT60J.A
N$16
  Top 0.813: R6.2 4.24,49.48 BUZZER.+
N$17
  Top 0.254: FCM1608.2 7.16,21.65 C9.1 7.06,22.41 7.55,22.9 10.1,22.9 10.4,22.6 10.4,21.76 C8.1 10.25,21.75 10.41,21.91 10.41,22.61 10.7,22.9 11.05,22.9 11.3,23.15 11.3,25.6 11.7,26 11.7,28.65 12.3,29.25 STM32F103CB.9
N$21
  Top 0.254: R4.1 T1.B
N$23
  Top 0.813: T1.C 11.75,49.4 BUZZER.-
NRF_CE  (via drill 0.4)
  Top 0.254: v18.65,23.4 18.65,24 | 18.65,24 18.65,24.4 18.2,24.85 STM32F103CB.19 | 18.65,24 | 18.65,24 18.42,23.5 | v18.65,23.4 18.42,23.5 | 18.65,24 | 18.65,24 18.88,23.5 | v18.65,23.4 18.88,23.5 | 18.65,24 18.42,23.5 | 18.42,23.5 | v18.65,23.4 18.42,23.5 | 18.65,24 18.88,23.5 | v18.65,23.4 18.88,23.5 | 18.65,24 18.42,23.5 | v18.65,23.4 18.42,23.5 | 18.65,24 18.88,23.5 | v18.65,23.4 18.88,23.5
  Bottom 0.254: NRF24L01_SMD.P$7 13.78,16.4 14,16.63 14,18.75 18.23,22.98 | 18.23,22.98 v18.65,23.4 | 18.23,22.98 18.74,23.16 v18.65,23.4 | 18.23,22.98 18.41,23.49 v18.65,23.4
NRF_CSN  (via drill 0.4)
  Top 0.254: v14.1,20.2 14.3,20.38 14.3,20.77 | 14.3,20.77 14.3,23.57 15.7,24.95 STM32F103CB.14 | 14.3,20.77 13.92,20.38 v14.1,20.2 | 14.3,20.77 14.35,20.22 v14.1,20.2
  Bottom 0.254: NRF24L01_SMD.P$6 12.5,16.43 12.63,16.56 12.63,18.71 13.68,19.77 | 13.68,19.77 v14.1,20.2 | 13.68,19.77 13.86,20.29 | v14.1,20.2 13.86,20.29 | 13.68,19.77 14.19,19.97 v14.1,20.2 | 13.68,19.77 13.86,20.29 | v14.1,20.2 13.86,20.29
NRF_IRQ  (via drill 0.4)
  Top 0.254: 19.7,35.54 19.7,35.8 v19.43,36.08 | 19.7,35.54 STM32F103CB.39 | 19.7,35.54 19.68,36.09 v19.43,36.08 | 19.7,35.54 19.27,35.88 v19.43,36.08
  Bottom 0.254: NRF24L01_SMD.P$2 7.43,16.73 9.85,19.15 9.85,21.6 13.25,25 13.25,27 14.75,28.5 14.75,35.8 15.47,36.52 18.98,36.52 19,36.5 | 19,36.5 v19.43,36.08 | 19,36.5 19.19,35.99 v19.43,36.08 | 19,36.5 19.51,36.31 v19.43,36.08
NSRST
  Top 0.254: R9.2 C5.1 8.71,25.36 9.05,25.7 10.75,25.7 11.25,26.2 11.25,29.7 11.8,30.25 STM32F103CB.7
PPM
  Top 0.254: CONN.5 6.49,12.51 6.2,12.8 R3.2
SPI1_MISO  (via drill 0.4)
  Top 0.254: v16.25,23.35 16.67,23.77 | 16.67,23.77 16.7,23.8 STM32F103CB.16 | 16.67,23.77 16.16,23.59 v16.25,23.35 | 16.67,23.77 16.48,23.26 v16.25,23.35
  Bottom 0.254: NRF24L01_SMD.P$3 8.7,17.4 14.5,23.2 15.67,23.2 | 15.67,23.2 16.1,23.2 v16.25,23.35 | 15.67,23.2 16.2,23.1 v16.25,23.35 | 15.67,23.2 16.09,23.54 v16.25,23.35
SPI1_MOSI  (via drill 0.4)
  Top 0.254: v17.2,23.05 17.2,23.65 | 17.2,23.65 STM32F103CB.17 | 17.2,23.65 | 17.2,23.65 16.97,23.16 | v17.2,23.05 16.97,23.16 | 17.2,23.65 | 17.2,23.65 17.43,23.16 | v17.2,23.05 17.43,23.16 | 17.2,23.65 16.97,23.16 | 16.97,23.16 | v17.2,23.05 16.97,23.16 | 17.2,23.65 17.43,23.16 | v17.2,23.05 17.43,23.16 | 17.2,23.65 16.97,23.16 | v17.2,23.05 16.97,23.16 | 17.2,23.65 17.43,23.16 | v17.2,23.05 17.43,23.16
  Bottom 0.254: NRF24L01_SMD.P$4 9.97,17.82 14.65,22.5 16.65,22.5 16.78,22.63 | 16.78,22.63 v17.2,23.05 | 16.78,22.63 17.29,22.82 v17.2,23.05 | 16.78,22.63 16.96,23.14 v17.2,23.05
SPI1_SCK  (via drill 0.4)
  Top 0.254: v15.15,21.7 15.3,21.7 15.5,21.9 15.5,22.19 | 15.5,22.19 15.5,24.15 16.2,24.85 STM32F103CB.15 | 15.5,22.19 15.03,21.92 v15.15,21.7 | 15.5,22.19 15.4,21.65 v15.15,21.7
  Bottom 0.254: NRF24L01_SMD.P$5 11.25,16.43 11.31,16.49 11.31,18.44 14.55,21.7 | 14.55,21.7 v15.15,21.7 | 14.55,21.7 | 14.55,21.7 15.04,21.47 | v15.15,21.7 15.04,21.47 | 14.55,21.7 | 14.55,21.7 15.04,21.93 | v15.15,21.7 15.04,21.93 | 14.55,21.7 15.04,21.47 | 15.04,21.47 | v15.15,21.7 15.04,21.47 | 14.55,21.7 15.04,21.93 | v15.15,21.7 15.04,21.93 | 14.55,21.7 15.04,21.47 | v15.15,21.7 15.04,21.47 | 14.55,21.7 15.04,21.93 | v15.15,21.7 15.04,21.93
SPI2_MISO  (via drill 0.4)
  Top 0.254: v34.35,28.38 34.17,28.55 33.78,28.55 | 33.78,28.55 30.95,28.55 30.7,28.8 29.88,28.8 29.82,28.75 STM32F103CB.27 | 33.78,28.55 34.18,28.19 v34.35,28.38 | 33.78,28.55 34.32,28.62 v34.35,28.38
  Bottom 0.254: RFM95W.2 34.55,27.81 | 34.55,27.81 34.55,28.18 v34.35,28.38 | 34.55,27.81 34.6,28.35 v34.35,28.38 | 34.55,27.81 34.17,28.2 v34.35,28.38
SPI2_MOSI  (via drill 0.4)
  Top 0.254: v32.23,29.23 32.1,29.35 31.64,29.35 | 31.64,29.35 30.7,29.35 30.6,29.25 STM32F103CB.28 | 31.64,29.35 32.08,29.02 v32.23,29.23 | 31.64,29.35 32.17,29.47 v32.23,29.23
  Bottom 0.254: RFM95W.3 32.55,28.72 | 32.55,28.72 32.55,28.9 v32.23,29.23 | 32.55,28.72 32.47,29.26 v32.23,29.23 | 32.55,28.72 32.09,29.01 v32.23,29.23
SPI2_SCK  (via drill 0.4)
  Top 0.254: v30.35,28.1 30.23,28.23 29.76,28.23 | 29.76,28.23 22.48,28.23 STM32F103CB.26 | 29.76,28.23 30.2,27.9 v30.35,28.1 | 29.76,28.23 30.3,28.34 v30.35,28.1
  Bottom 0.254: RFM95W.4 30.55,27.53 | 30.55,27.53 30.55,27.9 v30.35,28.1 | 30.55,27.53 30.6,28.08 v30.35,28.1 | 30.55,27.53 30.17,27.93 v30.35,28.1
SWCLK  (via drill 0.4)
  Top 0.254: STM32F103CB.37 20.7,35.55 20.85,35.7 21.07,35.7 21.27,35.5 21.27,34.55 21.9,33.92 22.05,33.92 | SWD.2 34.18,4.3 32.65,4.3 32.3,4.65 32.3,9.9 32.88,10.47 32.88,14.35 32.75,14.45 D2.C 32.2,15 30.43,16.77 30.43,19.7 | 22.05,33.92 v22.65,33.92 | v30.43,20.3 30.43,19.7 | 22.05,33.92 22.55,33.7 v22.65,33.92 | 22.05,33.92 22.55,34.15 v22.65,33.92 | 30.43,19.7 30.65,20.2 v30.43,20.3 | 30.43,19.7 30.2,20.2 v30.43,20.3
  Bottom 0.254: v22.65,33.92 23.25,33.92 | 23.25,33.92 27.12,33.92 27.57,33.48 27.57,23.55 30.25,20.87 | 30.25,20.87 30.43,20.7 v30.43,20.3 | 23.25,33.92 22.75,34.15 v22.65,33.92 | 23.25,33.92 22.75,33.7 v22.65,33.92 | 30.25,20.87 30.18,20.33 v30.43,20.3 | 30.25,20.87 30.61,20.47 v30.43,20.3
SWDIO  (via drill 0.4)
  Top 0.254: STM32F103CB.34 29.09,32.25 | 29.09,32.25 29.43,32.25 v29.65,32.48 | 34.45,11.85 D1.C | SWD.4 34.15,10.45 34.4,10.7 D1.C | v31.55,20.3 31.55,19.7 | 31.55,19.7 31.55,16.62 33.6,14.57 33.6,13.3 34.4,12.5 D1.C | 29.09,32.25 29.64,32.22 v29.65,32.48 | 29.09,32.25 29.47,32.65 v29.65,32.48 | 31.55,19.7 31.78,20.2 v31.55,20.3 | 31.55,19.7 31.32,20.2 v31.55,20.3
  Bottom 0.254: v29.65,32.48 30.25,32.48 | 30.25,32.48 31.18,32.48 31.55,32.1 31.55,20.9 | 31.55,20.9 v31.55,20.3 | 30.25,32.48 29.75,32.7 v29.65,32.48 | 30.25,32.48 29.75,32.25 v29.65,32.48 | 31.55,20.9 31.32,20.41 v31.55,20.3 | 31.55,20.9 31.78,20.41 v31.55,20.3
TIM2_CH2_BUZZER  (via drill 0.4)
  Top 0.254: v9.25,41.7 9.25,42.3 | 9.25,42.3 R4.2 | v12.4,28.4 12.55,28.4 12.7,28.25 12.98,28.25 | 12.98,28.25 STM32F103CB.11 | 12.98,28.25 12.56,28.59 v12.4,28.4 | 12.98,28.25 12.45,28.15 v12.4,28.4 | 9.25,42.3 | 9.25,42.3 9.02,41.8 | v9.25,41.7 9.02,41.8 | 9.25,42.3 | 9.25,42.3 9.48,41.8 | v9.25,41.7 9.48,41.8 | 9.25,42.3 9.02,41.8 | 9.02,41.8 | v9.25,41.7 9.02,41.8 | 9.25,42.3 9.48,41.8 | v9.25,41.7 9.48,41.8 | 9.25,42.3 9.02,41.8 | v9.25,41.7 9.02,41.8 | 9.25,42.3 9.48,41.8 | v9.25,41.7 9.48,41.8
  Bottom 0.254: 9.25,41.1 9.25,35.48 8.47,34.7 8.47,32.9 7.67,32.1 7.67,28.93 8.2,28.4 11.8,28.4 | 9.25,41.1 v9.25,41.7 | 11.8,28.4 v12.4,28.4 | 11.8,28.4 12.29,28.17 v12.4,28.4 | 11.8,28.4 12.29,28.63 v12.4,28.4 | 9.25,41.1 9.48,41.59 | v9.25,41.7 9.48,41.59 | 9.25,41.1 9.02,41.59 | v9.25,41.7 9.02,41.59 | 9.25,41.1 9.48,41.59 | 9.48,41.59 | v9.25,41.7 9.48,41.59 | 9.25,41.1 9.02,41.59 | v9.25,41.7 9.02,41.59 | 9.25,41.1 9.48,41.59 | v9.25,41.7 9.48,41.59 | 9.25,41.1 9.02,41.59 | v9.25,41.7 9.02,41.59
TIM3_CH1
  Top 0.254: R3.1 7.9,17.8 8.3,18.2 8.3,19.95 9,20.65 10.95,20.65 11.9,21.6 11.9,25.05 15.2,28.35 15.2,32.4 15.8,33 18.55,33 19.2,33.65 STM32F103CB.40
USART1_RX
  Top 0.254: R10.2 8.9,19.85 9.2,20.15 11.05,20.15 12.35,21.45 12.35,24.9 15.65,28.2 20.1,28.2 20.55,28.65 20.55,30 21.3,30.75 STM32F103CB.31
USART1_TX  (via drill 0.4)
  Top 0.254: v9.72,14.38 9.38,14.72 9.38,14.86 | 9.38,14.86 9.38,19.3 9.72,19.65 11.4,19.65 12.82,21.07 12.82,24.8 15.78,27.75 20.38,27.75 21.05,28.43 21.05,29.9 21.4,30.25 STM32F103CB.30 | 9.38,14.86 9.48,14.33 v9.72,14.38 | 9.38,14.86 9.85,14.59 v9.72,14.38
  Bottom 0.254: R2.2 R17.2 13.44,10.09 14.1,10.09 14.97,10.96 T2.C 14.97,13.32 14,14.29 10.25,14.29 | 10.25,14.29 10.09,14.27 v9.72,14.38 | 10.25,14.29 9.94,14.51 v9.72,14.38 | 10.25,14.29 9.69,14.13 v9.72,14.38
USART2_TX  (via drill 0.4)
  Top 0.254: v12.43,27.38 12.43,27.4 12.78,27.75 12.89,27.75 | 12.89,27.75 STM32F103CB.12 | 12.89,27.75 12.36,27.62 v12.43,27.38 | 12.89,27.75 12.65,27.26 v12.43,27.38
  Bottom 0.254: 12.2,26.82 12.2,25.98 11.6,25.38 11.6,24.4 9.3,22.1 9.3,19.35 6.83,16.88 6.83,14.5 7.31,14.02 7.31,13.45 8.32,12.44 R12.2 | 12.2,26.82 12.2,27.15 v12.43,27.38 | 12.2,26.82 12.6,27.19 v12.43,27.38 | 12.2,26.82 12.17,27.36 v12.43,27.38
USART3_RX
  Top 0.254: STM32F103CB.22 19.7,25.5 20.35,24.85 20.35,23.48 21.02,22.8 21.85,22.8 22.25,22.4 22.25,21.3 22.4,21.15 23.8,21.15 24.9,20.05 24.9,14.9 25.7,14.1 27.7,14.1 27.85,13.95 R16.1
USART3_TX
  Top 0.254: STM32F103CB.21 19.2,25.25 19.85,24.6 19.85,23.35 20.85,22.35 21.6,22.35 21.8,22.15 21.8,20.9 22.05,20.65 23.55,20.65 24.45,19.75 24.45,12.7 25.3,11.9 R21.1
VBAT_S
  Top 0.254: R13.1 24.6,8.8 24.5,8.9 R1.1 24.5,10.93 24,11.45 24,19.55 23.35,20.2 18.15,20.2 17.95,20.4 17.95,23.55 17.7,23.8 STM32F103CB.18
VCC  (via drill 0.4, 0.6)
  Top 0.254: C4.2 12.85,38.88 12.93,38.8 13.6,38.8 15.2,37.2 STM32F103CB.48 | STM32F103CB.1 13,33.25 12.75,33.5 12.75,36.21 C12.1 | STM32F103CB.36 23.15,33.25 23.5,33.6 23.5,37.2 23,37.7 C18.1 | I2C.3 37.22,4.28 36.75,4.75 36.75,11.25 36.55,11.45 R11.1 R7.1 36.55,18.48 36.51,18.51 | 21,25.2 C17.1 | STM32F103CB.24 20.7,25.5 21,25.2 | 21,25.2 21,24.97 | 21,24.97 21,24.6 v21.2,24.4 | v20.6,19.2 20.6,18.6 | 20.6,18.6 20.6,17.77 C6.1 | v13.85,6.67 14.15,6.67 14.4,6.92 | 14.4,6.92 14.47,7 14.47,7.35 13.71,8.11 | 36.51,18.51 v35.88,19.15 | 21,24.97 20.95,24.42 v21.2,24.4 | 21,24.97 21.38,24.57 v21.2,24.4 | 20.6,18.6 20.83,19.09 | v20.6,19.2 20.83,19.09 | 20.6,18.6 20.37,19.09 | v20.6,19.2 20.37,19.09 | 20.6,18.6 20.83,19.09 | 20.83,19.09 | v20.6,19.2 20.83,19.09 | 20.6,18.6 20.37,19.09 | v20.6,19.2 20.37,19.09 | 20.6,18.6 20.83,19.09 | v20.6,19.2 20.83,19.09 | 20.6,18.6 20.37,19.09 | v20.6,19.2 20.37,19.09 | 14.4,6.92 13.85,6.93 v13.85,6.67 | 14.4,6.92 14.04,6.51 v13.85,6.67 | 36.51,18.51 36.2,19.28 v35.88,19.15 | 36.51,18.51 35.74,18.82 v35.88,19.15
  Top 0.406: SWD.1 34.15,2.45 34.65,2.95 38.1,2.95 38.6,3.45 I2C.3
  Top 0.813: 4.35,19.25 4,18.9 4,16.8 3.55,16.35 1.35,16.35 0.9,15.9 0.9,1.25 1.35,0.8 12.07,0.8 12.38,1.1 12.38,2.17 C16.1 12.4,4.33 C3.+ | FCM1608.1 4.35,19.25 | 4.35,19.25 4,19.6 4,24.2 4.15,24.2 4.15,24.35 | 4.15,24.35 4.15,24.6 4,24.75 4,40 | 4,40 4,44.05 4.2,44.3 4.2,45.22 R6.1 | R9.1 4.17,24.38 4.15,24.35 | 12.05,40.6 12.71,39.94 C4.2 C12.1 | 12.05,40.6 4.65,40.6 4.1,41.1 4.45,40.45 4,40 | C18.1 22.46,39.49 21.7,40.25 R20.2 20.32,40.28 20.32,40.77 19.85,41.25 12.7,41.25 12.05,40.6 | C3.+ 16.55,4.35 16.75,4.15 16.75,2.76 REG1117.2 16.76,1.44 17.3,0.9 v22,0.9 | REG1117.4 14.65,9.05 13.71,8.11 12.55,6.95 12.55,4.47 C3.+ | v36.7,33.52 36.7,19.98 v35.88,19.15
  Top 1.422: v16.76,11.1 16.76,15.12
  Bottom 0.254: v21.2,24.4 21.2,23.8 | 21.2,23.8 21.2,19.8 21.02,19.62 | 21.02,19.62 v20.6,19.2 | R17.1 13.3,6.9 | 13.3,6.9 13.53,6.67 v13.85,6.67 | 21.2,23.8 21.43,24.3 | v21.2,24.4 21.43,24.3 | 21.2,23.8 20.97,24.3 | v21.2,24.4 20.97,24.3 | 21.2,23.8 21.43,24.3 | 21.43,24.3 | v21.2,24.4 21.43,24.3 | 21.2,23.8 20.97,24.3 | v21.2,24.4 20.97,24.3 | 21.2,23.8 21.43,24.3 | v21.2,24.4 21.43,24.3 | 21.2,23.8 20.97,24.3 | v21.2,24.4 20.97,24.3 | 21.02,19.62 20.51,19.43 v20.6,19.2 | 21.02,19.62 20.84,19.11 v20.6,19.2 | 13.3,6.9 13.67,6.5 v13.85,6.67 | 13.3,6.9 13.84,6.93 v13.85,6.67
  Bottom 0.813: v16.76,11.1 16.75,11.36 16.75,14.04 16.76,14.05 | NRF24L01_SMD.P$8 15.05,14.45 15.35,14.15 16.66,14.15 16.76,14.05 | 16.76,14 16.76,14.05 | 16.76,14.05 16.76,14.25 17.65,14.25 18.04,14.63 C6.1 18.11,15.12 19.55,15.12 23.57,19.15 v35.88,19.15 | v22,0.9 23.34,0.9 R18.1 25.84,1.56 26.62,2.35 26.62,3.8 27.1,4.28 USART.3 | C13.+ C11.1 30.6,42.33 RFM95W.13 30.55,39.77 36.7,33.62 v36.7,33.52
  pour Top: 23.75,6 9.7,6 9.7,19.7 23.75,19.7
VI  (via drill 0.6)
  Top 0.254: C20.1 R13.2 24.6,4.88 24.07,4.35 20.93,4.35 20.6,4.03 20.6,3.23 20.12,2.75 REG1117.3 | REG1117.3
  Top 0.813: v19.05,4.4 REG1117.3
  Bottom 0.813: BAT60J.C 16.25,5.12 17.07,5.95 C10.1 v19.05,4.4

### Text on the board
bPlace: PPM | CMD | AriloTX | V+ | GND | TEL | (c) J.ARIGITA